# EAGLE design Micro RC Receiver HP (EAGLE 7.6.0)
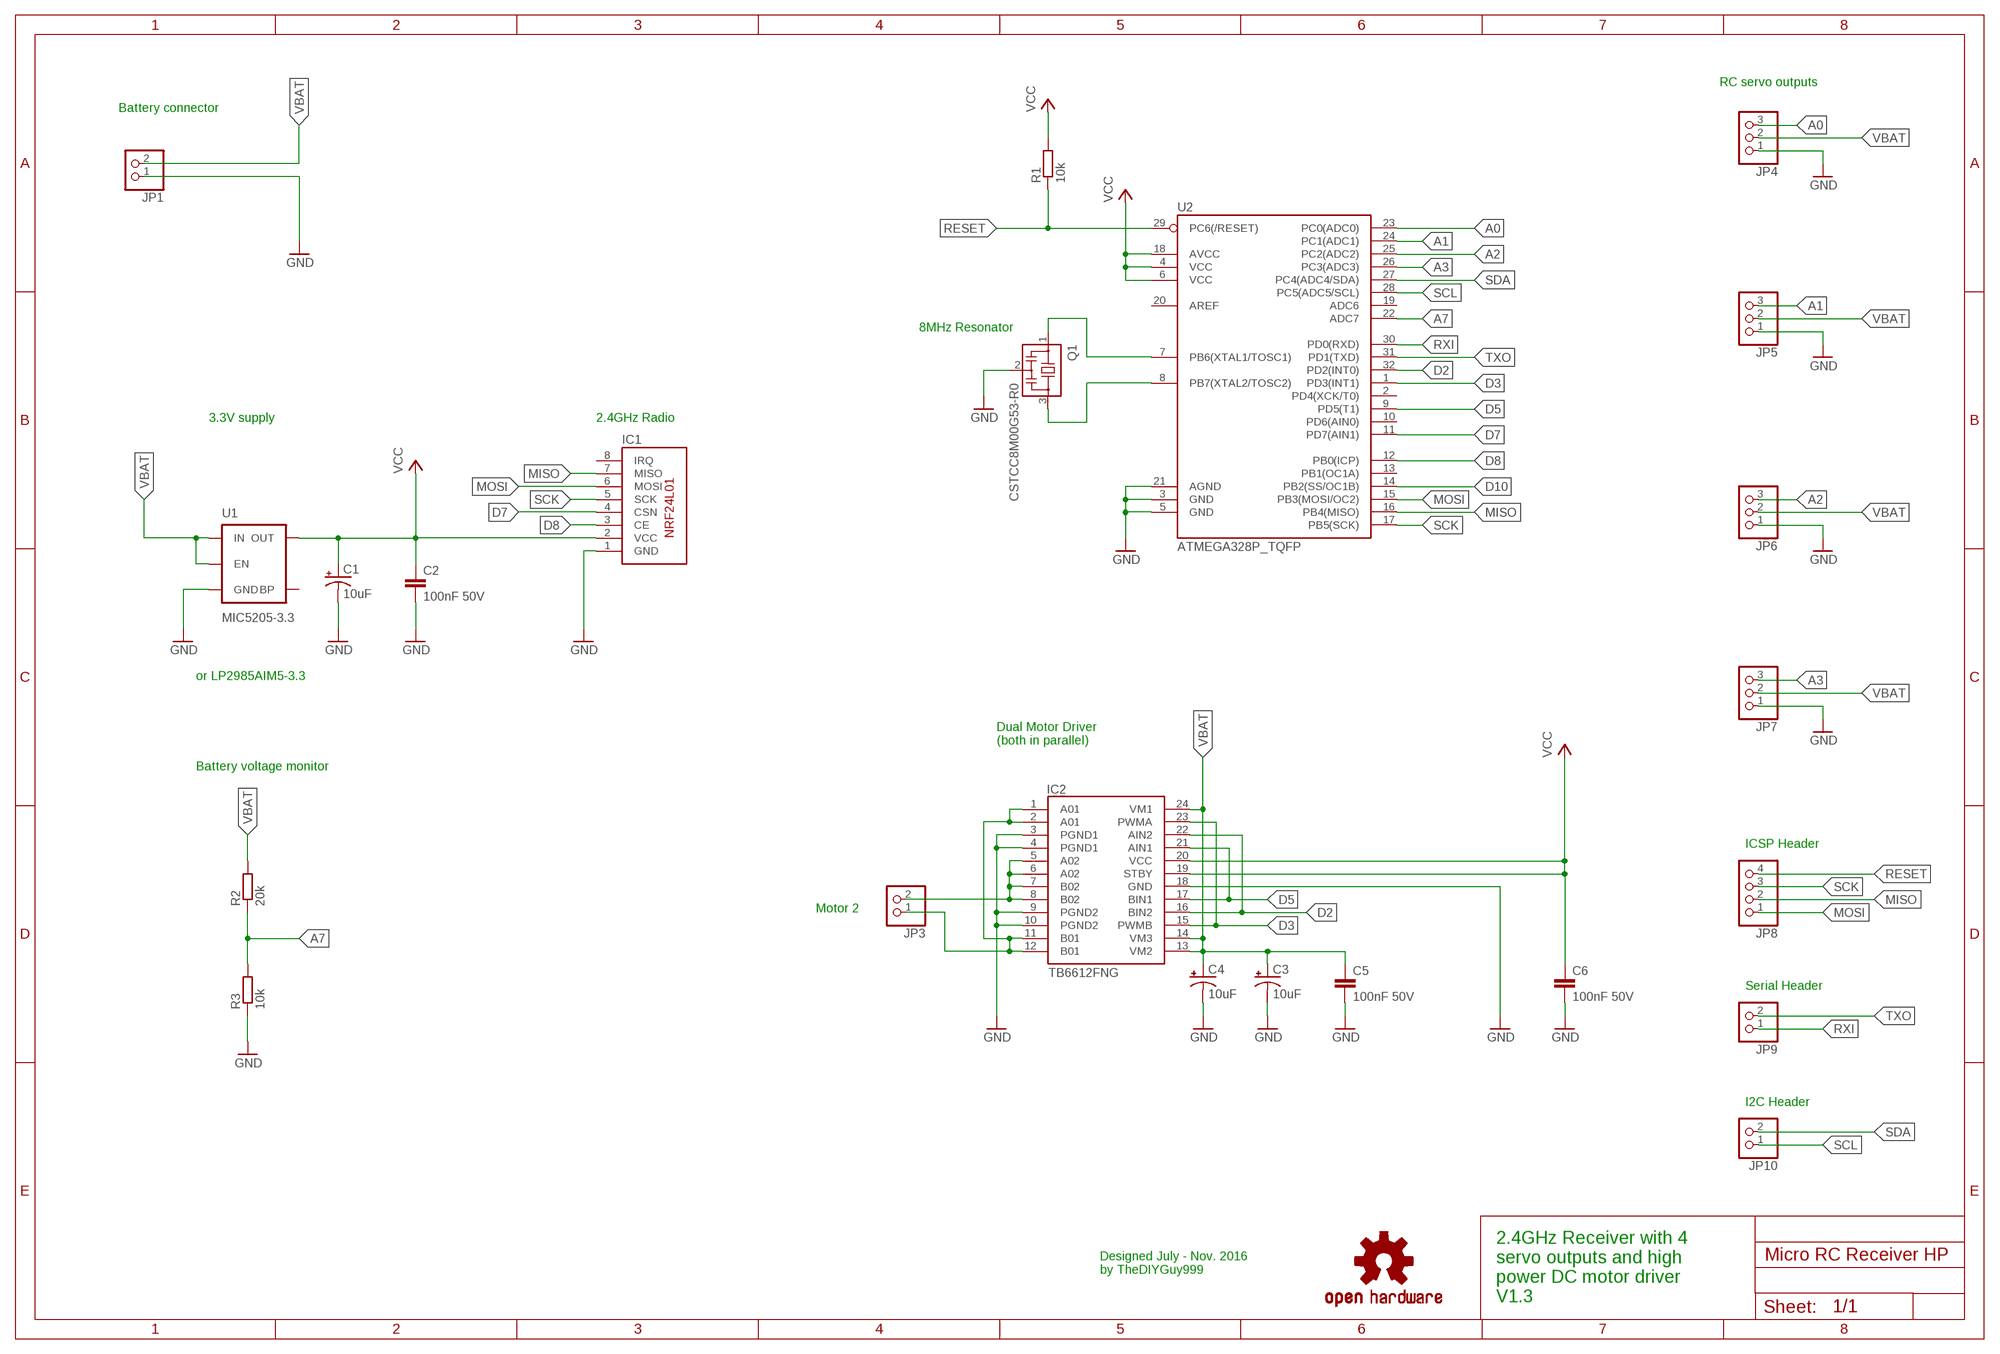
[diagram p0: schematic, sheet 1]

## Parts
C1  10uF  10UF-16V-10%(TANT)  [EIA3216]
C2  100nF 50V  C-EUC0805  [C0805]
C3  10uF  10UF-16V-10%(TANT)  [EIA3216]
C4  10uF  10UF-16V-10%(TANT)  [EIA3216]
C5  100nF 50V  C-EUC0805  [C0805]
C6  100nF 50V  C-EUC0805  [C0805]
IC1  NRF24L01SMD  [NRF24L01_SMD]
IC2  TB6612FNG  [SSOP24]
JP1  PINHD-1X2  [1X02]
JP3  PINHD-1X2  [1X02]
JP4  PINHD-1X3  [1X03]
JP5  PINHD-1X3  [1X03]
JP6  PINHD-1X3  [1X03]
JP7  PINHD-1X3  [1X03]
JP8  PINHD-1X4  [1X04]
JP9  PINHD-1X2  [1X02]
JP10  PINHD-1X2  [1X02]
LOGO1  OSHW-LOGOS  [OSHW-LOGO-S]
Q1  CSTCC8M00G53-R0  [CSTCC]
R1  10k  R-EU_R0805  [R0805]
R2  20k  R-EU_R0805  [R0805]
R3  10k  R-EU_R0805  [R0805]
U1  MIC5205-3.3  MIC52053.3V  [SOT23-5]
U2  ATMEGA328P_TQFP  [TQFP32-08]

## Nets
A0: JP4.3 U2.23(PC0(ADC0))
A1: JP5.3 U2.24(PC1(ADC1))
A2: JP6.3 U2.25(PC2(ADC2))
A3: JP7.3 U2.26(PC3(ADC3))
A7: R2.1 R3.2 U2.22(ADC7)
D2: IC2.16(BIN2) IC2.22(AIN2) U2.32(PD2(INT0))
D3: IC2.15(PWMB) IC2.23(PWMA) U2.1(PD3(INT1))
D5: IC2.17(BIN1) IC2.21(AIN1) U2.9(PD5(T1))
D7: IC1.4(CSN) U2.11(PD7(AIN1))
D8: IC1.3(CE) U2.12(PB0(ICP))
D10: U2.14(PB2(SS/OC1B))
GND: C1.C(-) C2.2 C3.C(-) C4.C(-) C5.2 C6.2 IC1.1(GND) IC2.3(PGND1) IC2.4(PGND1) IC2.9(PGND2) IC2.10(PGND2) IC2.18(GND) JP1.1 JP4.1 JP5.1 JP6.1 JP7.1 Q1.2 R3.1 U1.2(GND) U2.3(GND) U2.5(GND) U2.21(AGND)
MISO: IC1.7(MISO) JP8.2 U2.16(PB4(MISO))
MOSI: IC1.6(MOSI) JP8.1 U2.15(PB3(MOSI/OC2))
N$1: Q1.3 U2.8(PB7(XTAL2/TOSC2))
N$2: Q1.1 U2.7(PB6(XTAL1/TOSC1))
N$3: IC2.1(A01) IC2.2(A01) IC2.11(B01) IC2.12(B01) JP3.1
N$5: IC2.5(A02) IC2.6(A02) IC2.7(B02) IC2.8(B02) JP3.2
RESET: JP8.4 R1.1 U2.29(PC6(/RESET))
RXI: JP9.1 U2.30(PD0(RXD))
SCK: IC1.5(SCK) JP8.3 U2.17(PB5(SCK))
SCL: JP10.1 U2.28(PC5(ADC5/SCL))
SDA: JP10.2 U2.27(PC4(ADC4/SDA))
TXO: JP9.2 U2.31(PD1(TXD))
VBAT: C3.A(+) C4.A(+) C5.1 IC2.13(VM2) IC2.14(VM3) IC2.24(VM1) JP1.2 JP4.2 JP5.2 JP6.2 JP7.2 R2.2 U1.1(IN) U1.3(EN)
VCC: C1.A(+) C2.1 C6.1 IC1.2(VCC) IC2.19(STBY) IC2.20(VCC) R1.2 U1.5(OUT) U2.4(VCC) U2.6(VCC) U2.18(AVCC)
Unconnected: IC1.8(IRQ) U1.4(BP) U2.2(PD4(XCK/T0)) U2.10(PD6(AIN0)) U2.13(PB1(OC1A)) U2.19(ADC6) U2.20(AREF)

## Notes on the sheet
- RC servo outputs
- Battery connector
- 8MHz Resonator
- 3.3V supply | 2.4GHz Radio
- or LP2985AIM5-3.3
- Dual Motor Driver
  (both in parallel)
- Battery voltage monitor
- ICSP Header
- Motor 2
- Serial Header
- I2C Header
- Designed July - Nov. 2016
  by TheDIYGuy999
- 2.4GHz Receiver with 4
  servo outputs and high
  power DC motor driver
  V1.3

## Library data of the parts
C1 C3 C4 = SparkFun-Capacitors:10UF-16V-10%(TANT): CAP-00811 1206/EIA-3216 Tantalum capacitor; PROD_ID: CAP-00811
C2 C5 C6 = rcl:C-EU: CAPACITOR, European symbol
IC1 = 00_custom:NRF24L01: 2.4GHz Radio Module
IC2 = 00_custom:TB6612FNG
JP1 JP3 JP9 JP10 = 00_custom_pinhead:PINHD-1X2: PIN HEADER
JP4-JP7 = 00_custom_pinhead:PINHD-1X3: PIN HEADER
JP8 = 00_custom_pinhead:PINHD-1X4: PIN HEADER
LOGO1 = SparkFun-Aesthetics:OSHW-LOGO: Open Source Hardware Logo This logo indicates the piece of hardware it is found on incorporates a OSHW license and/or adheres to the definition of open source hardware found here: http://freedomdefined.org/OSHW
Q1 = 00_custom:CSTCC: Resonator Source: murata.co.jp; DISTRELEC: 174-62-633
R1-R3 = rcl:R-EU_: RESISTOR, European symbol
U1 = SparkFun-PowerIC:MIC5205: MIC5205 150mA vreg 3.3V - VREG-00822 5V - VREG-00823; PROD_ID: VREG-00822
U2 = SparkFun-DigitalIC:ATMEGA328P_TQFP; PROD_ID: IC-09069

## Board
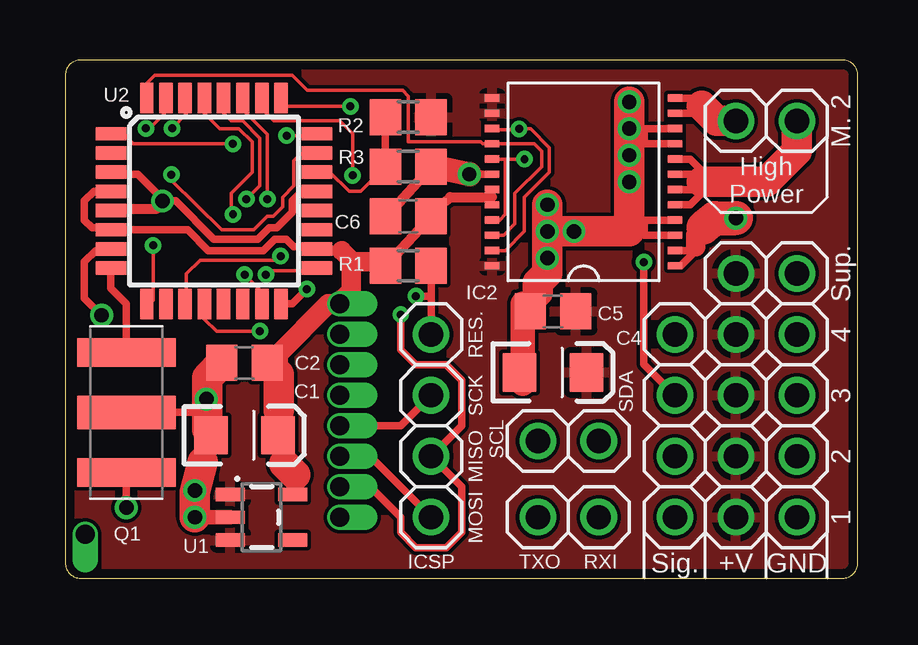
[diagram p1: board, top side]
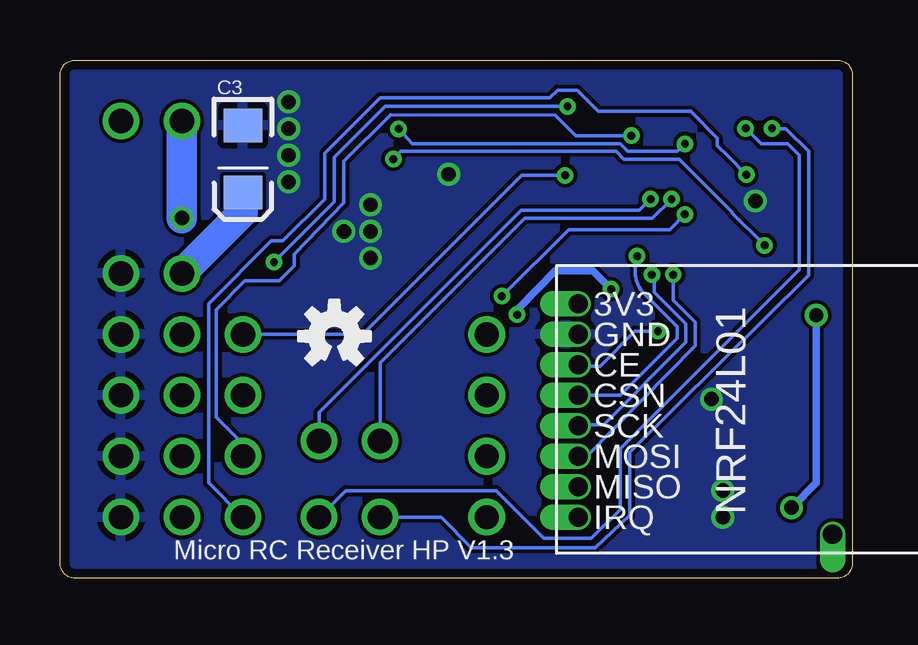
[diagram p2: board, bottom side, seen from below]

Size 33.02 x 21.59 mm. Coordinates in mm from the lower left corner, seen from the top.
Outline: 0.64,0 32.38,0 arc90 33.02,0.64 33.02,20.95 arc90 32.38,21.59 0.64,21.59 arc90 0,20.95 0,0.64 arc90 0.64,0
Copper layers (1*16): Top 0.0356mm / dielectric 1.5011mm / Bottom 0.0356mm
Design rules "OSHPark_LaenPCBOrder *": minimum track width 6mil, minimum drill 13mil, track to track 6mil, track to pad 6mil, pad to pad 6mil, via to via 6mil, smd to smd 6mil, copper to edge 15mil, drill to drill 6mil, minimum pad ring 5mil, minimum via ring 7mil, stop-mask expansion 1mil, vias tented up to drill 24mil, thermal gap 10mil

### Footprints (pad centres in the part's own frame; a part is rotated, then mirrored left to right if it is on the bottom)
EIA3216 = smd 1.4 x 1.6: A 1.4,0; C -1.4,0
C0805 = smd 1.3 x 1.5: 1 -0.95,0; 2 0.95,0
NRF24L01_SMD = drill 0.8 pad 1.016 offset: 1 1.27,0; 2 0,0; 3 2.54,0; 4 3.81,0; 5 5.08,0; 6 6.35,0; 7 7.62,0; 8 8.89,0; 9 9.6,10.6
SSOP24 = smd 0.305 x 0.61: 1 -3.493,-3.81; 2 -2.857,-3.81; 3 -2.223,-3.81; 4 -1.587,-3.81; 5 -0.953,-3.81; 6 -0.318,-3.81; 7 0.318,-3.81; 8 0.953,-3.81; 9 1.587,-3.81; 10 2.223,-3.81; 11 2.857,-3.81; 12 3.493,-3.81; 13 3.493,3.81; 14 2.857,3.81; 15 2.223,3.81; 16 1.587,3.81; 17 0.953,3.81; 18 0.318,3.81; 19 -0.318,3.81; 20 -0.953,3.81; 21 -1.587,3.81; 22 -2.223,3.81; 23 -2.857,3.81; 24 -3.493,3.81
1X02 = drill 1.016 pad 1.524: 1 -1.27,0; 2 1.27,0
1X03 = drill 1.016 pad 1.524: 1 -2.54,0; 2 0,0; 3 2.54,0
1X04 = drill 1.016 pad 1.524: 1 -3.81,0; 2 -1.27,0; 3 1.27,0; 4 3.81,0
CSTCC = smd 1.2 x 4.1: 1 -2.5,0; 3 2.5,0 | smd 1.4 x 4.1: 2 0,0
R0805 = smd 1.3 x 1.5: 1 -0.95,0; 2 0.95,0
SOT23-5 = smd 0.55 x 1.2: 1 -0.95,-1.3; 2 0,-1.3; 3 0.95,-1.3; 4 0.95,1.3; 5 -0.95,1.3
TQFP32-08 = smd 1.27 x 0.559: 1 -4.293,2.8; 2 -4.293,2; 3 -4.293,1.2; 4 -4.293,0.4; 5 -4.293,-0.4; 6 -4.293,-1.2; 7 -4.293,-2; 8 -4.293,-2.8; 17 4.293,-2.8; 18 4.293,-2; 19 4.293,-1.2; 20 4.293,-0.4; 21 4.293,0.4; 22 4.293,1.2; 23 4.293,2; 24 4.293,2.8 | smd 0.559 x 1.27: 9 -2.8,-4.293; 10 -2,-4.293; 11 -1.2,-4.293; 12 -0.4,-4.293; 13 0.4,-4.293; 14 1.2,-4.293; 15 2,-4.293; 16 2.8,-4.293; 25 2.8,4.293; 26 2,4.293; 27 1.2,4.293; 28 0.4,4.293; 29 -0.4,4.293; 30 -1.2,4.293; 31 -2,4.293; 32 -2.8,4.293

### Placement (x,y rotation side)
C1  7.46,5.95 0 top
C2  7.46,8.97 180 top
C3  25.4,17.46 270 bottom
C4  20.32,8.57 0 top
C5  20.32,11.11 180 top
C6  14.29,15.08 180 top
IC1  11.43,11.43 270 bottom
IC2  21.59,16.51 90 top
JP1  29.21,12.7 180 top
JP3  29.21,19.05 0 top
JP4  27.94,2.54 180 top
JP5  27.94,5.08 180 top
JP6  27.94,7.62 180 top
JP7  27.94,10.16 180 top
JP8  15.24,6.35 90 top
JP9  20.95,2.54 180 top
JP10  20.95,5.71 0 top
LOGO1  21.59,10.08 0 bottom
Q1  2.54,6.91 90 top
R1  14.29,13.02 180 top
R2  14.29,19.21 0 top
R3  14.29,17.14 180 top
U1  8.18,2.54 270 top
U2  6.19,15.72 0 top

### Tracks (layer width: path | path; a pad name or v marks a point on that pad's centre or on a via)
A0  (via drill 0.33)
  Top 0.152: U2.23 10.36,17.68 9.8,17.68 9.53,17.4 9.53,16.35 9.05,15.88 9.05,15.48 8.65,15.08 8.41,15.08 7.86,14.53 6.51,14.53 4.42,16.59 v4.42,16.81
  Bottom 0.152: v4.42,16.81 5.16,17.55 5.64,18.02 5.64,18.34 6.75,19.45 10.59,19.45 11.47,20.34 12.29,20.34 12.62,20.02 19.67,20.02 21.99,17.7 21.99,15.8 23.73,14.05 24.21,14.05 26.83,11.43 26.83,3.97 JP4.3
A1  (via drill 0.33)
  Top 0.152: v9.22,18.44 10.36,18.44 U2.24
  Bottom 0.152: v9.22,18.44 11.54,18.44 12.38,19.29 19.24,19.31 21.19,17.36 21.19,15.64 23.26,13.49 23.26,13.02 23.89,12.38 25.32,12.38 26.51,11.19 26.51,6.7 25.45,5.64 25.45,5.18 JP5.3
A2  (via drill 0.33)
  Top 0.152: 9.03,19.65 8.99,19.96 U2.25 8.99,19.66 v11.87,19.66
  Top 0.305: v24.11,13.17 24.11,8.91 JP6.3
  Bottom 0.152: v11.87,19.66 19.47,19.66 21.59,17.54 21.59,15.68 v24.11,13.17
A3  (via drill 0.33)
  Top 0.152: U2.26 8.23,19.96 8.23,19.51 8.69,19.05 11.43,19.05 11.97,18.51 v11.97,16.78
  Bottom 0.152: v11.97,16.78 13.78,16.78 20.4,10.16 JP7.3
A7
  Top 0.152: U2.22 11.02,16.92 11.83,16.11 12.31,16.11 R3.2
  Top 0.305: R2.1 R3.2
D2
  Top 0.152: U2.32 3.39,20.62 3.73,20.95 9.45,20.95 10.08,20.32 14.05,20.32 14.29,20.08 14.29,18.18 17.3,18.18 17.38,18.1 IC2.16 19.53,18.1 19.84,17.78 19.84,17.14 18.73,16.03 18.73,14.76 18.26,14.29 IC2.22
D3  (via drill 0.33)
  Top 0.152: v6.98,18.1 2.82,18.1 2.52,18.44 1.98,18.44 U2.1 | IC2.15 17.83,18.75 17.83,18.68 18.86,18.68 v18.91,18.72 19.38,18.72 20.16,17.94 20.16,16.91 19.13,15.88 19.13,14.45 18.34,13.65 IC2.23
  Bottom 0.152: v6.98,18.1 7.3,17.78 9.37,17.78 9.68,18.1 18.34,18.1 v18.91,18.72
D5  (via drill 0.33)
  Top 0.152: v3.66,13.87 3.66,11.58 3.5,11.43 U2.9 | v19.13,17.46 18.34,17.46 | 18.34,17.46 IC2.17 | IC2.21 18.1,14.92 18.34,15.16 18.34,17.46
  Bottom 0.152: v3.66,13.87 5,15.21 5,15.24 7.22,17.46 9.53,17.46 9.84,17.78 18.81,17.78 v19.13,17.46
D7  (via drill 0.33)
  Top 0.152: U2.11 5.03,11.43 5.03,12.68 5.61,13.26 8.81,13.26 v8.97,13.41
  Bottom 0.152: v8.97,13.41 9.05,13.34 9.05,12.75 arc-45 8.68,11.85 7.3,10.48 7.3,10 9.68,7.62 IC1.4
D8  (via drill 0.33)
  Top 0.152: v8.1,10.29 6.3,10.29 5.79,10.79 U2.12
  Top 0.305: U2.12
  Bottom 0.152: v8.1,10.29 9.06,10.29 10.52,8.84 11.43,8.84 IC1.3
GND  (via drill 0.6)
  Top 0.305: IC2.10 24.13,18.73 24.13,18.1 IC2.9 23.5,18.1 | IC2.3 24.13,14.29 24.13,14.45 | 24.13,14.45 24.13,14.92 IC2.4 | 19.37,11.43 19.68,11.43 19.68,11.91 | 23.5,14.45 24.13,14.45 | U2.3 1.9,16.83 3.02,16.83 4.13,15.72 | 1.9,15.4 U2.5 | 5.9,6.19 C1.C | 5.74,7.46 5.9,7.62 | U2.21 9.85,16.12 9.45,15.72 9.45,15.24 8.81,14.61 8.49,14.61 8.02,14.13 6.19,14.13 4.6,15.72 4.13,15.72 | 4.13,15.72 4.05,15.64 v4.05,15.72 | Q1.2 5.82,6.91 5.9,6.83 | R3.1 15.4,17.14 | v16.83,16.83 IC2.18
  Top 0.406: 1.9,15.4 3.81,15.4 4.05,15.64 | C6.2 13.34,15.01 R3.1
  Top 0.61: U1.2 v5.4,2.54 | 5.71,4.84 C1.C
  Top 1.016: C4.C 19.05,8.1 19.05,11.43 19.37,11.43 C5.2 | 15.4,17.14 v16.83,16.83
  Top 1.27: v20.08,15.56 v20.08,14.45 | 19.68,11.91 19.68,12.3 20.08,12.7 v20.08,14.45 | v20.08,14.45 v21.19,14.45 23.5,14.45 23.5,18.1 v23.5,19.84 | 5.9,6.19 5.9,6.83 5.9,7.62 5.9,8.36 C2.2 | v5.4,2.54 5.4,3.57 5.71,4.84
  other vias: 23.5,16.51 20.08,13.34 5.87,7.46 23.5,18.73 5.4,3.65 23.5,17.62
  pour Bottom: -2.54,24.13 35.56,24.13 35.56,-2.54 -2.54,-2.54
MISO  (via drill 0.33)
  Top 0.152: U2.16
  Top 0.305: IC1.7 12.7,3.81 13.97,2.54 13.97,1.91 14.61,1.27 15.88,1.27 16.51,1.91 16.51,3.81 JP8.2 16.51,6.35 16.51,8.26 15.88,8.89 14.61,8.89 13.97,9.52 v13.97,10.98 | U2.16 9.45,11.43 v10.06,12.04
  Bottom 0.305: v10.06,12.04 10.82,12.8 12.39,12.8 13.89,11.27 13.97,11.19 v13.97,10.98
MOSI  (via drill 0.33)
  Top 0.152: v7.47,12.65 8.08,12.04 8.08,11.43 U2.15
  Top 0.305: IC1.6 12.7,5.08 JP8.1
  Bottom 0.152: v7.47,12.65 7.47,11.58 6.55,10.67 6.55,9.69 11.06,5.11 11.43,5.11 IC1.6
N$1
  Top 0.305: U2.8 1.9,12.07 2.54,11.43 Q1.3
N$2  (via drill 0.6)
  Top 0.305: U2.7 1.83,13.65 1.27,13.65 0.79,13.18 0.79,11.67 v1.51,10.95 | v2.54,2.94 Q1.1
  Bottom 0.305: v1.51,10.95 1.51,3.97 v2.54,2.94
N$3  (via drill 0.6)
  Top 0.305: IC2.12 26.19,20 26.51,19.68 26.19,19.37 IC2.11 | IC2.1 25.64,13.02 26.27,13.65 | 26.27,13.65 IC2.2 | 26.27,13.65 26.27,13.81 | 26.27,14.29 26.59,14.61
  Top 0.813: 26.27,13.81 26.27,14.29
  Top 1.27: 26.51,19.68 27.15,19.05 JP3.1
  Top 1.422: 26.59,14.61 26.67,14.68 27.07,15 v27.94,15
  Bottom 1.27: v27.94,15 JP3.1
N$5
  Top 0.305: IC2.5 26.04,15.56 26.67,16.19 | IC2.6 26.67,16.19 | 26.67,16.19 26.67,16.51 26.67,16.83 | IC2.7 26.67,16.83 | 26.67,16.83 26.04,17.46 IC2.8
  Top 1.27: JP3.2 30.48,17.78 29.21,16.51 26.67,16.51 26.51,16.51
RESET  (via drill 0.33)
  Top 0.152: 15.24,13.09 R1.1 | U2.29 5.79,19.37 6.43,18.73 7.22,18.73 7.78,18.18 7.78,16.91 6.91,16.03 6.91,15.24 v6.99,15.16
  Top 0.305: JP8.4 15.24,11.75 | 15.24,11.75 15.24,13.09 | v14.61,11.75 15.24,11.75
  Bottom 0.152: v6.99,15.16 7.62,14.53 11.83,14.53 v14.61,11.75
RXI  (via drill 0.33)
  Top 0.152: v4.45,18.75 5.03,19.36 5.03,19.96 U2.30
  Bottom 0.152: JP9.1 21.11,3.65 14.84,3.65 12.86,1.67 10.87,1.67 9.68,2.86 9.68,5.4 2.22,12.86 2.22,17.62 2.7,18.1 3.81,18.1 3.81,18.11 v4.45,18.75
SCK  (via drill 0.33)
  Top 0.152: v8.36,12.65 8.51,12.8 10.36,12.8 U2.17
  Top 0.305: IC1.5 13.97,6.35 JP8.3
  Bottom 0.152: v8.36,12.65 8.26,12.65 8.26,11.91 6.94,10.6 6.94,9.83 10.36,6.4 11.43,6.4 IC1.5
SCL  (via drill 0.33)
  Top 0.152: U2.28 6.59,19.36 6.91,19.05 7.38,19.05 8.1,18.34 8.1,16.35 v7.54,15.8
  Bottom 0.152: v7.54,15.8 8.33,15 13.65,15 19.68,8.97 JP10.1
SDA  (via drill 0.33)
  Top 0.152: U2.27 7.39,19.52 8.41,18.49 v8.41,15.8
  Bottom 0.152: v8.41,15.8 8.89,15.32 13.81,15.32 22.23,6.91 JP10.2
TXO  (via drill 0.33)
  Top 0.152: v3.35,18.75 3.5,18.75 4.12,19.36 4.12,19.96 U2.31
  Bottom 0.152: v3.35,18.75 3.34,18.73 2.78,18.73 1.83,17.78 1.83,12.62 9.29,5.24 9.29,2.62 10.72,1.27 15.88,1.27 17.14,2.54 JP9.2
VBAT
  Bottom 1.27: C3.A 25.4,15.24 JP1.2
  pour Top: -1.27,22.86 34.29,22.86 34.29,-1.27 -1.27,-1.27
VCC
  Top 0.152: U1.5 9.47,3.5 9.53,3.81 | IC2.20 17.78,15.88 IC2.19
  Top 0.305: U2.4 1.19,16.12 0.79,15.72 0.79,14.92 1.11,14.61 1.81,14.61 U2.6 5.09,14.52 5.95,13.65 8.26,13.65 8.73,14.13 9.21,14.13 9.53,13.81 10.39,13.81 U2.18
  Top 0.406: 9.58,4.32 9.53,3.81 | 11.51,13.65 10.55,13.65 U2.18 | 9.13,4.76 9.13,5.69 C1.A 8.86,6.96 8.89,6.99 | 13.49,13.18 C6.1 15.24,15.24 15.95,15.8 16.03,15.88 17.78,15.88
  Top 0.61: 13.34,13.17 13.49,13.18
  Top 0.813: 8.86,8.52 8.86,9.34 10.95,11.43 11.35,11.43 | 11.35,11.43 IC1.2 | 11.35,11.43 11.91,11.99 11.91,13.26 | 11.91,13.26 11.51,13.65 | 11.91,13.26 11.99,13.18 13.34,13.17 R1.2
  Top 1.27: C2.1 8.86,8.52 8.89,8.49 8.89,6.99 | 9.58,4.32 9.13,4.76

### Text on the board
bPlace: Micro RC Receiver HP V1.3
tNames: M. 2 | High / Power | Sup. | RES. | 4 | SCK | SDA | 3 | SCL | MISO | 2 | MOSI | 1 | ICSP | TXO | RXI | Sig. | +V | GND